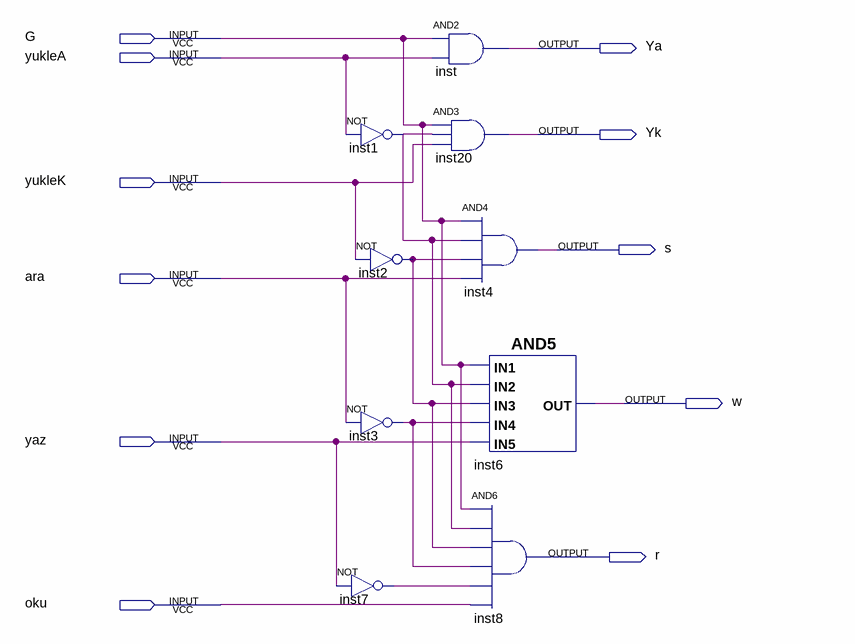
[diagram p0: schematic sheet]
// Quartus schematic kontrolDevresi.bdf as structural Verilog: 9 symbols, 11 pins
module kontrolDevresi (
  input  G,
  input  yukleA,
  input  yukleK,
  input  ara,
  input  yaz,
  input  oku,
  output Ya,
  output Yk,
  output s,
  output w,
  output r
);

  wire inst1_out, inst2_out, inst3_out, inst7_out;

  not inst1 (inst1_out, yukleA);
  not inst2 (inst2_out, yukleK);
  not inst3 (inst3_out, ara);
  not inst7 (inst7_out, yaz);
  and inst (Ya, G, yukleA);
  and inst20 (Yk, G, inst1_out, yukleK);
  and inst4 (s, G, inst1_out, inst2_out, ara);
  and inst6 (w, G, inst1_out, inst2_out, inst3_out, yaz);
  and inst8 (r, G, inst1_out, inst2_out, inst3_out, inst7_out, oku);
endmodule
